# EasyEDA Pro project OctoSlime_TouchPad.eprj

# Schematic Schematic1
Create Date: 2022-07-29; Page Name: P1; Project Name: OctoSlime_Switch_Unit; Schematic Name: Schematic1; Update Date: 2022-08-04; Company: EmbeddedAT; Drawed: KeonMan; Reviewed: KeonMan; Version: 1.0
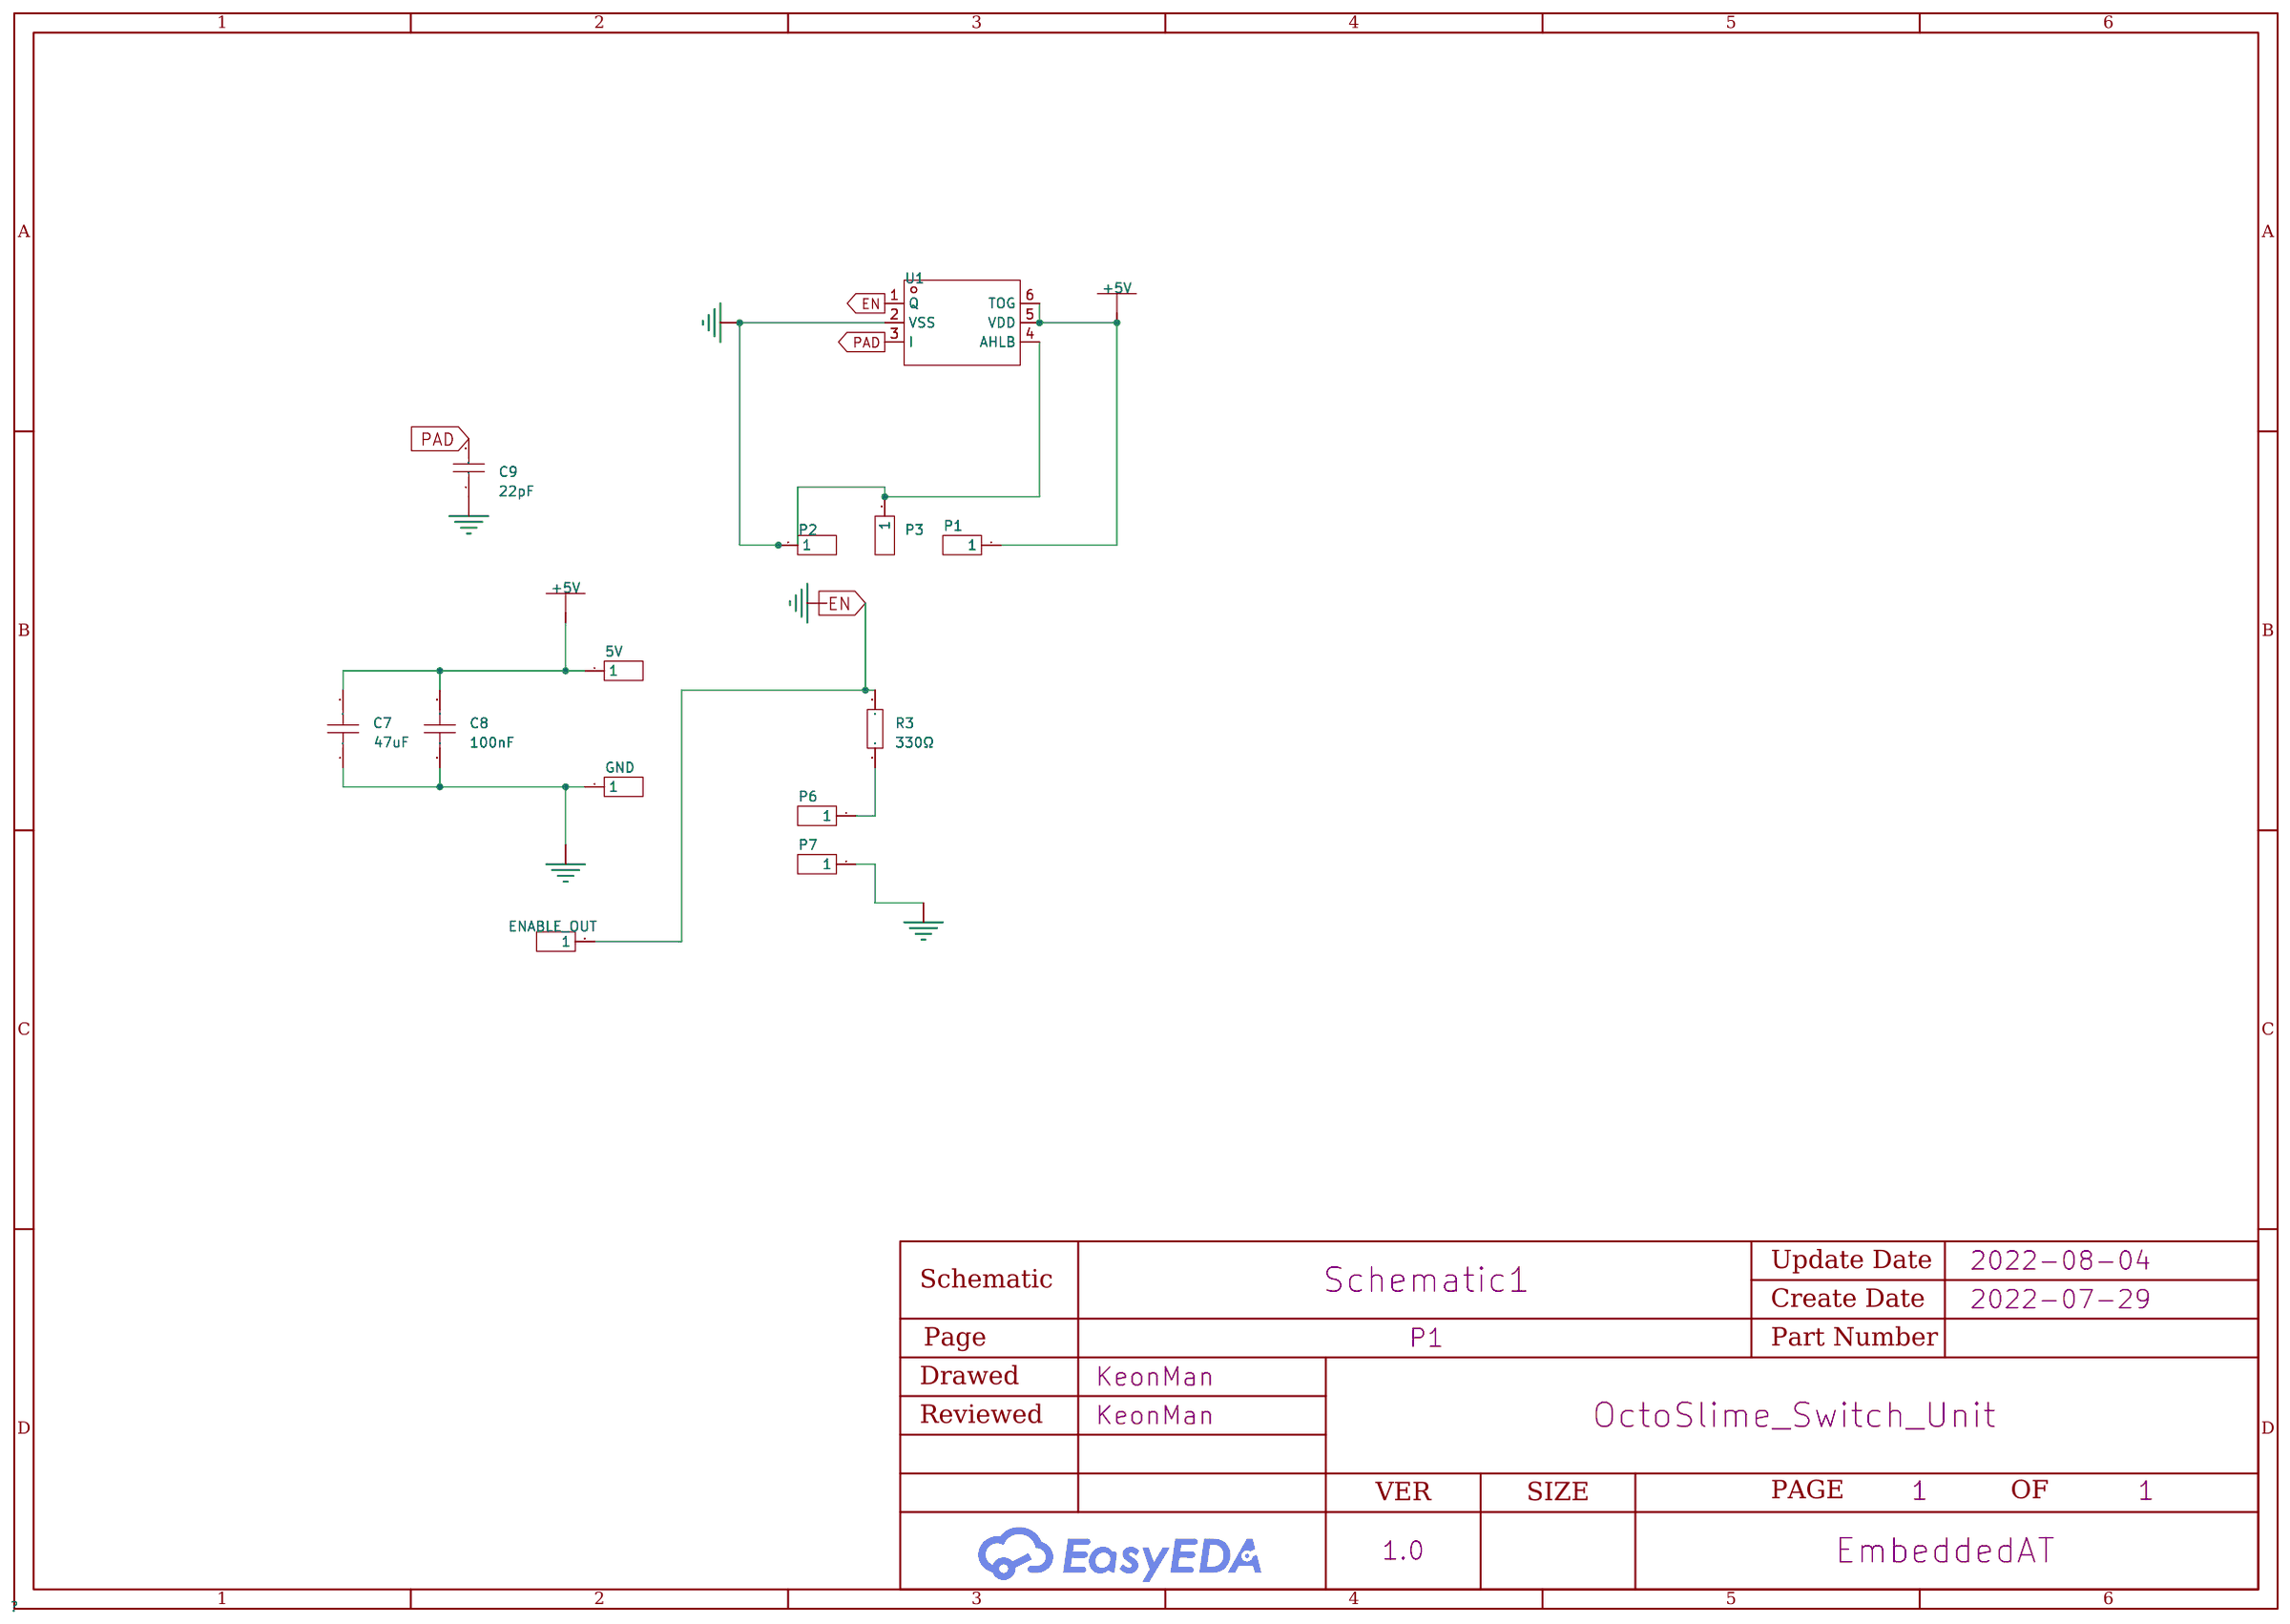
[diagram p0: schematic sheet]

## Parts
5V  -  [HDR-TH_1P-P2.54-V-M]  (no BOM)
C7  47uF  [C1206]
C8  100nF  [C0402]
C9  22pF  [C0805]
ENABLE_OUT  -  [HDR-TH_1P-P2.54-V-M]  (no BOM)
GND  -  [HDR-TH_1P-P2.54-V-M]  (no BOM)
P1  -  [HDR-TH_1P-P2.54-V-M]  (no BOM)
P2  -  [HDR-TH_1P-P2.54-V-M]  (no BOM)
P3  -  [HDR-TH_1P-P2.54-V-M]  (no BOM)
P6  -  [HDR-TH_1P-P2.54-V-M]  (no BOM)
P7  -  [HDR-TH_1P-P2.54-V-M]  (no BOM)
R3  330Ω  [R0805]
U1  -  [SOT-23-6_L2.9-W1.6-P0.95-LS2.8-BR]  (no BOM)

## Library data of the parts
5V ENABLE_OUT GND P1-P3 P6 P7 = 2.54-1*1P针: 间距:-;总PIN位数:1;排数:1;插针结构:-;行距:-;安装类型:直插;圆针/方针:-;额定电流:-;额定电压:-;配合针长度:-;塑高:-;触头材质:-;触头镀层:-;颜色:黑色;; LCSC Part Name: 1x1P; Supplier Part: C81276; Manufacturer: BOOMELE(博穆精密); Supplier Footprint: 插件; JLCPCB Part Class: Extended Part; Supplier: LCSC; Number of Pins: 1; Number of Rows: 1; Mounting Type: 直插; Color: 黑色; LCSC On Sale: 1; JLCPCB On Sale: 1; Type: 直插; Connector Type: 排针
C7 = CL31A476MPHNNNE: 容值:47uF;精度:±20%;额定电压:10V;温度系数:X5R;; LCSC Part Name: 47uF ±20% 10V; Supplier Part: C96123; Manufacturer: SAMSUNG(三星); Supplier Footprint: 1206; JLCPCB Part Class: Basic Part; Datasheet: https://atta.szlcsc.com/upload/public/pdf/source/20170228/1488267692219.pdf; Supplier: LCSC; Tolerance: ±20%; Voltage Rated: 10V; Temperature Coefficient: X5R
C8 = CL05B104KB54PNC: 容值:100nF;精度:±10%;额定电压:50V;温度系数:X7R;; LCSC Part Name: 100nF ±10% 50V; Supplier Part: C307331; Manufacturer: SAMSUNG(三星); Supplier Footprint: 0402; JLCPCB Part Class: Basic Part; Datasheet: https://atta.szlcsc.com/upload/public/pdf/source/20181009/C307331_222F7C870FD3EA5F46F538B483443886.pdf; Supplier: LCSC; Tolerance: ±10%; Voltage Rated: 50V; Temperature Coefficient: X7R
C9 = CL21C220JBANNNC: 容值:22pF;精度:±5%;额定电压:50V;温度系数:C0G;; LCSC Part Name: 22pF ±5% 50V; Supplier Part: C1804; Manufacturer: SAMSUNG(三星); Supplier Footprint: 0805; JLCPCB Part Class: Basic Part; Datasheet: https://atta.szlcsc.com/upload/public/pdf/source/20160103/1457707697973.pdf; Supplier: LCSC; Tolerance: ±5%; Voltage Rated: 50V; Temperature Coefficient: C0G
R3 = 0805W8F3300T5E: 电阻类型:厚膜电阻;阻值:330Ω;精度:±1%;功率:125mW;温度系数:±100ppm/;最大工作电压:150V;工作温度范围:-55~+155;; LCSC Part Name: 330Ω ±1%; Supplier Part: C17630; Manufacturer: UNI-ROYAL(厚声); Supplier Footprint: 0805; JLCPCB Part Class: Basic Part; Datasheet: https://atta.szlcsc.com/upload/public/pdf/source/20200306/C422600_1E6D84923E4A46A82E41ADD87F860B5C.pdf; Supplier: LCSC; Type: 厚膜电阻; Tolerance: ±1%; Power(Watts): 125mW; Temperature Coefficient: ±100ppm/; Overload Voltage (Max): 150V; Operating Temperature Range: -55~+155
U1 = TTP223E-BA6: 单按键触摸感应开关; LCSC Part Name: TTP223E-BA6 停产; Supplier Part: C129457; Manufacturer: TONTEK(台湾通泰); Supplier Footprint: SOT-23-6; JLCPCB Part Class: Extended Part; Datasheet: https://atta.szlcsc.com/upload/public/pdf/source/20170914/C129457_1505360037116968239.pdf; Supplier: LCSC

## Nets
+5V: 5V.1 C7.2 C8.2 P1.1 U1.5(VDD) U1.6(TOG)
GND: C7.1 C8.1 C9.1 GND.1 P2.1 P3.1 P7.1 U1.2(VSS) U1.4(AHLB)
EN: ENABLE_OUT.1 R3.2 U1.1(Q)
PAD: C9.2 U1.3(I)
Net-(P6-1): P6.1 R3.1

# Board PCB2
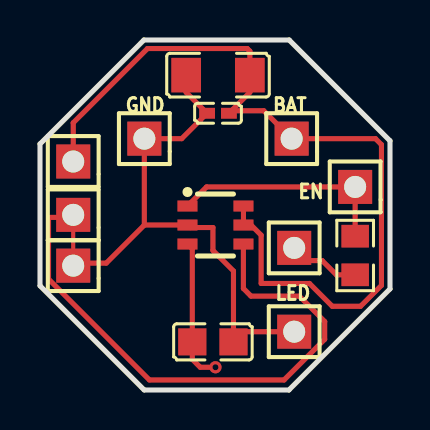
[diagram p1: board, top side]
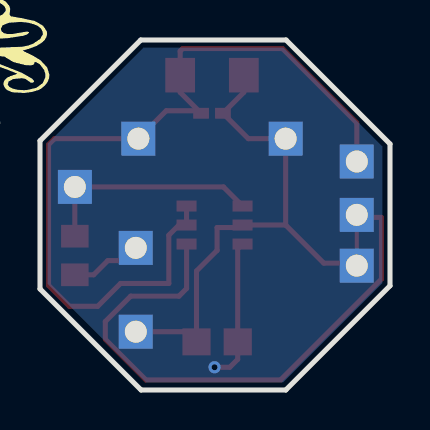
[diagram p2: board, bottom side, seen from below]

Outline 17.5 x 17.5 mm; copper layers: Top Layer, Bottom Layer. Coordinates in mm from the lower left corner of the outline.
Outline path: 0,12.3 0,5.21 5.21,0 12.45,0 17.5,5.05 17.5,12.46 12.46,17.5 5.2,17.5 0,12.3
Stack: Top Layer 0.035mm / Dielectric1 1.51mm FR4 er 4.5 / Bottom Layer 0.035mm

## Design rules (mm)
spacing safeClearance (default): track to track 0.152, other pairs 0.152 to 0.3
track width trackWidth (default): min 0.127, default 0.254, max 2.54
differential pair differentialPair (default): width min 0.127, default 0.254, max 2.54; gap min 0.152, default 0.152
via viaSize (default): diameter min 0.5, default 0.61, max 10; hole min 0.3, default 0.305, max 6

## Placement (name value [footprint] x y rotation side)
5V  -  [HDR-TH_1P-P2.54-V-M]  1.66 11.42 0 top
BAT  -  [HDR-TH_1P-P2.54-V-M]  12.58 12.57 0 top
C7  47uF  [C1206]  8.9 15.74 0 top
C8  100nF  [C0402]  8.9 13.84 0 top
C9  22pF  [C0805]  8.65 2.41 180 top
EN  -  [HDR-TH_1P-P2.54-V-M]  15.76 10.15 0 top
GND  -  [HDR-TH_1P-P2.54-V-M]  5.22 12.57 0 top
GND#2  -  [HDR-TH_1P-P2.54-V-M]  1.66 6.22 0 top
LED  -  [HDR-TH_1P-P2.54-V-M]  12.71 7.11 0 top
P3  -  [HDR-TH_1P-P2.54-V-M]  1.66 8.76 0 top
P7  -  [HDR-TH_1P-P2.54-V-M]  12.71 2.92 0 top
R3  330Ω  [R0805]  15.76 6.73 90 top
U1  -  [SOT-23-6_L2.9-W1.6-P0.95-LS2.8-BR]  8.77 8.25 180 top

## Footprints (pads in the part's own frame, mm; a bottom-side part is the same pattern mirrored in y, then rotated)
C0402
  rect 0.79x0.541 smd: 1(-0.546,0) 2(0.546,0)
C0805
  rect 1.409x1.351 smd: 1(-1.028,0) 2(1.031,0)
C1206
  rect 1.486x1.727 smd: 1(-1.593,0) 2(1.593,0)
HDR-TH_1P-P2.54-V-M
  rect 1.7x1.7 hole 1.1: 1(0,0)
R0805
  rect 1.133x1.377 smd: 1(-0.965,0) 2(0.965,0)
SOT-23-6_L2.9-W1.6-P0.95-LS2.8-BR
  rect 1.001x0.551 smd: 1(1.399,-0.95) 2(1.399,0) 3(1.399,0.95) 4(-1.399,0.95) 5(-1.399,0) 6(-1.399,-0.95)

## Nets
+5V: 5V.1 BAT.1 C7.2 C8.2 U1.5 U1.6
GND: C7.1 C8.1 C9.1 GND.1 GND#2.1 P3.1 P7.1 U1.2 U1.4
EN: EN.1 R3.2 U1.1
PAD: C9.2 U1.3
$1N2744: LED.1 R3.1

## Via types
v1: diameter 0.61, hole 0.305, Top Layer to Bottom Layer, 1 via

## Routing (per net, layer and track width the routed paths; a pad name or vN(x,y) marks a point on that pad's centre or on a via; arc(x,y) is an arc through that point)
+5V: length 42.5
  Top Layer w0.254: 9.57,13.96 10.49,14.88 10.49,16.94 10.36,17.07 5.37,17.07 1.66,13.36 5V.1 ; 9.57,13.96 11.19,13.96 BAT.1 16.77,12.57 17.07,12.27 17.07,5.23 16.03,4.19 14.62,4.19 13.47,5.33 11.06,5.33 11.06,7.74 10.55,8.25 U1.5 U1.6 ; 9.57,13.96 C8.2
GND: length 59.2
  Top Layer w0.2: P3.1 GND#2.1
  Top Layer w0.254: U1.4 10.17,7.3 10.17,5.07 10.55,4.69 12.96,4.69 14.23,3.42 14.23,2.53 12.2,0.5 5.47,0.5 0.43,5.55 0.43,8.63 1.53,8.63 P3.1 ; 7.31,15.87 7.31,14.88 8.35,13.84 7.08,12.57 GND.1 5.22,8.25 ; 5.22,8.25 3.31,6.34 1.79,6.34 GND#2.1 ; 5.22,8.25 U1.2 7.5,8.12 8.65,8.12 8.65,6.98 9.67,5.95 C9.1 10.18,2.92 P7.1
EN: length 11.2
  Top Layer w0.254: R3.2 EN.1 8.33,10.15 U1.1
PAD: length 7.2
  Top Layer w0.254: U1.3 7.62,7.06 C9.2 7.62,1.53 8.01,1.14 v1(8.77,1.14)
$1N2744: length 4
  Top Layer w0.254: R3.1 14.82,5.76 14.11,6.47 12.71,6.47 LED.1

## Copper pours and planes (outline as drawn; the poured copper is in the pictures)
PAD on Bottom Layer: 0.38,17.12 17.12,17.12 17.12,0.38 0.38,0.38
